# Altium schematic sheet 04_8V_GENERATION.SchDoc: =TitleParameter
size A3; Organization: ASISGUARD; Address1: Kemalpasa, Kemalpasa Cd. No:290 D:292H, 35060 Bornova/Izmir/Turkey; SheetNumber: 4; SheetTotal: 12
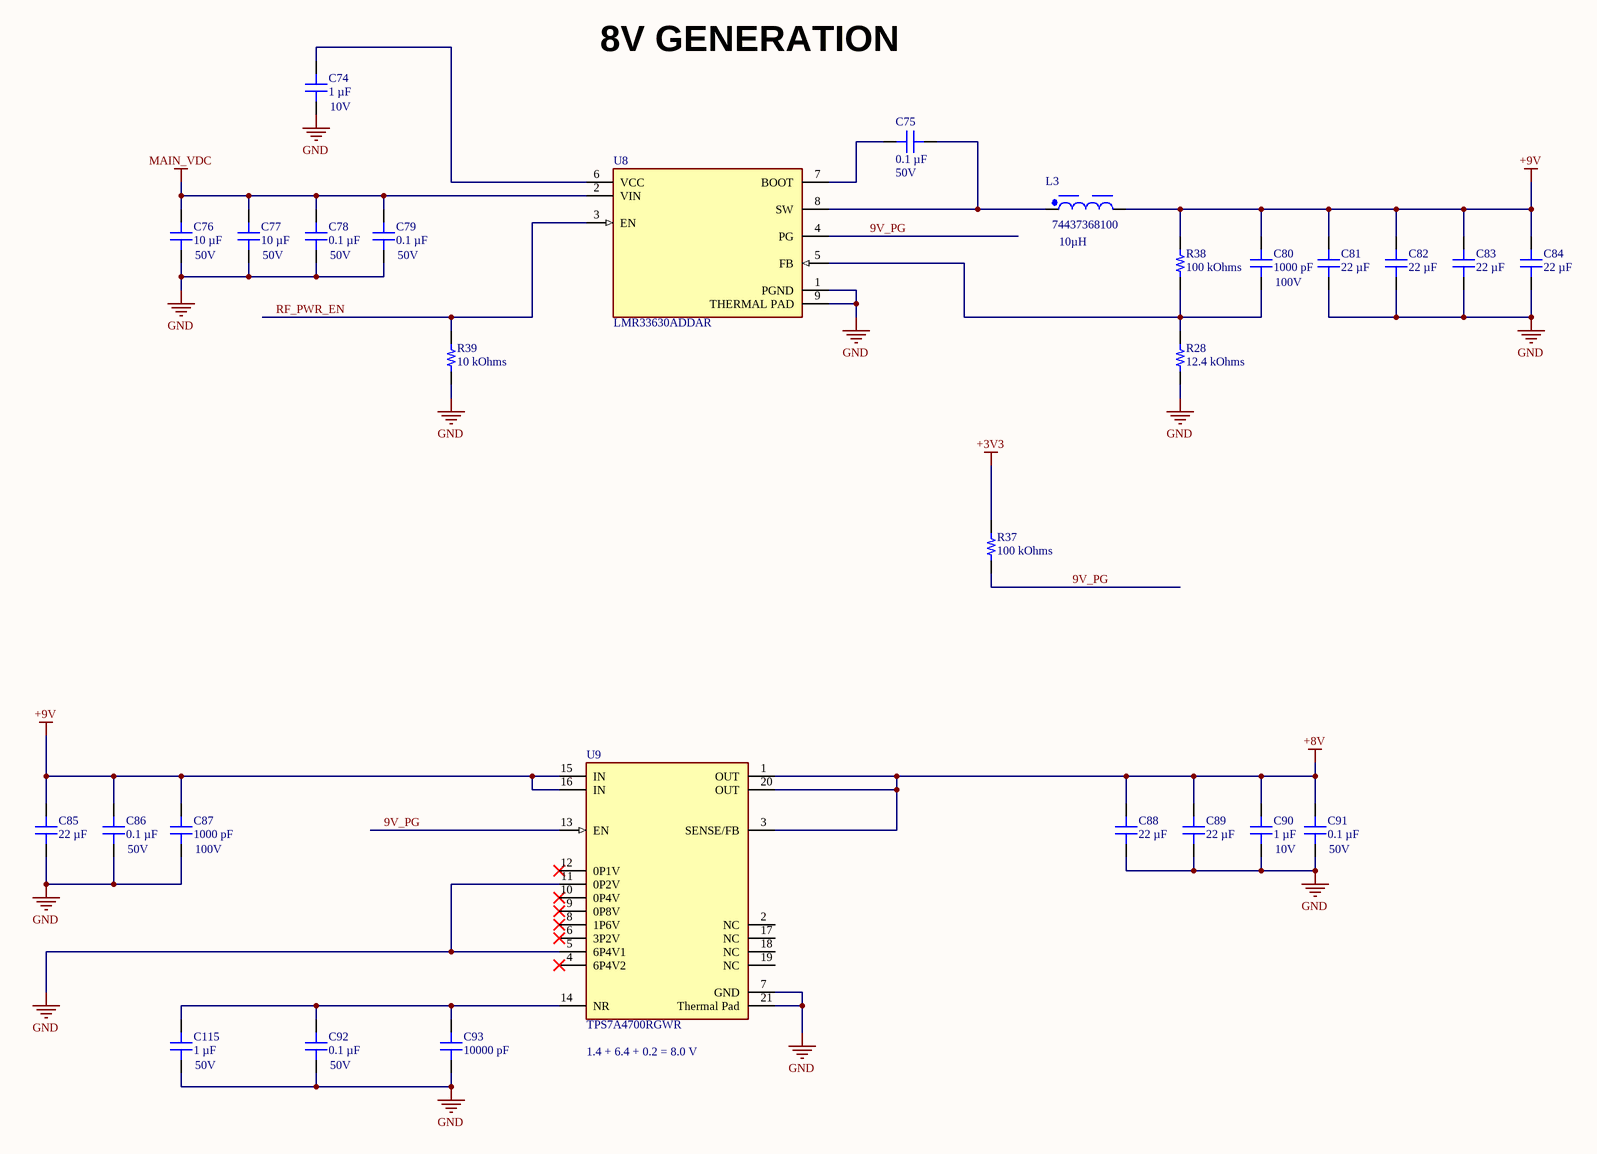
[diagram p0: 04_8V_GENERATION.SchDoc]

## Parts
C74  Voltage - Rated: 10V  [CAP 0402_1005]  (hidden comment: 1 µF)
C75  Voltage - Rated: 50V  [CAP 0402_1005]  (hidden comment: 0.1 µF)
C76  Voltage - Rated: 50V  [CAP 1206_3216 - 0.8MM]  (hidden comment: 10 µF)
C77  Voltage - Rated: 50V  [CAP 1206_3216 - 0.8MM]  (hidden comment: 10 µF)
C78  Voltage - Rated: 50V  [CAP 0402_1005]  (hidden comment: 0.1 µF)
C79  Voltage - Rated: 50V  [CAP 0402_1005]  (hidden comment: 0.1 µF)
C80  Voltage - Rated: 100V  [CAP 0402_1005]  (hidden comment: 1000 pF)
C81  22 µF  [CAP 0805_2012]
C82  22 µF  [CAP 0805_2012]
C83  22 µF  [CAP 0805_2012]
C84  22 µF  [CAP 0805_2012]
C85  22 µF  [CAP 0805_2012]
C86  Voltage - Rated: 50V  [CAP 0402_1005]  (hidden comment: 0.1 µF)
C87  Voltage - Rated: 100V  [CAP 0402_1005]  (hidden comment: 1000 pF)
C88  22 µF  [CAP 0805_2012]
C89  22 µF  [CAP 0805_2012]
C90  Voltage - Rated: 10V  [CAP 0402_1005]  (hidden comment: 1 µF)
C91  Voltage - Rated: 50V  [CAP 0402_1005]  (hidden comment: 0.1 µF)
C92  Voltage - Rated: 50V  [CAP 0402_1005]  (hidden comment: 0.1 µF)
C93  10000 pF  [CAP 0402_1005]
C115  Voltage - Rated: 50V  [CAP 0805_2012]  (hidden comment: 1 µF)
L3  74437368100  Inductance: 10µH  [WE-LHMI_1040]
R28  12.4 kOhms  [RES 0402_1005]
R37  100 kOhms  [RES 0402_1005]
R38  100 kOhms  [RES 0402_1005]
R39  10 kOhms  [RES 0402_1005]
U8  LMR33630ADDAR  [FP-DDA0008J-MFG]
U9  TPS7A4700RGWR  [FP-RGW0020A-MFG]

## Nets
+3V3: R37.2
+8V: C88.2 C89.2 C90.1 C91.2 U9.1(OUT) U9.3(SENSE/FB) U9.20(OUT)
+9V: C80.2 C81.2 C82.2 C83.2 C84.2 C85.2 C86.2 C87.2 L3.2 R38.2 U9.15(IN) U9.16(IN)
GND: C74.2 C76.1 C77.1 C78.1 C79.1 C81.1 C82.1 C83.1 C84.1 C85.1 C86.1 C87.1 C88.1 C89.1 C90.2 C91.1 C92.1 C93.1 C115.1 R28.1 R39.1 U8.1(PGND) U8.9(THERMAL_PAD) U9.5(6P4V1) U9.7(GND) U9.11(0P2V) U9.21(Thermal_Pad)
MAIN_VDC: C76.2 C77.2 C78.2 C79.2 U8.2(VIN)
9V_PG: R37.1 U8.4(PG) U9.13(EN)
RF_PWR_EN: R39.2 U8.3(EN)
NetC74_1: C74.1 U8.6(VCC)
NetC75_1: C75.1 L3.1 U8.8(SW)
NetC75_2: C75.2 U8.7(BOOT)
NetC80_1: C80.1 R28.2 R38.1 U8.5(FB)
NetC92_2: C92.2 C93.2 C115.2 U9.14(NR)

Not connected (* = marked no-connect by the designer): U9 2(NC) 4(6P4V2)* 6(3P2V)* 8(1P6V)* 9(0P8V)* 10(0P4V)* 12(0P1V)* 17(NC) 18(NC) 19(NC)

## Notes on the sheet
- 8V GENERATION
- (near U9) 1.4 + 6.4 + 0.2 = 8.0 V
- Proje/Project:
- Sayfa Adı/Document Name:
- Çizilme Tarihi/Drawing Date
- E. CAGLAV
- Tasarlayan/Designed By
- Sayfa/Sheet:
- Revision:
- of
- Son Güncelleme/Last Edit Date
- Kontrol eden/Checked By
- Onaylayan/Approved By
- Boyut/Size:
- Varyant/Variant:
- Dil/Language:
- A3
- ENG

## Library data of the parts
C74 C90 = GRM155C71A105KE11D: CAP CER 1UF 10V X7S 0402; manufacturer: Murata Electronics; Tolerance: ±10%; Part Number: GRM155C71A105KE11D; Capacitance: 1 µF; Applications: General Purpose; componentlink1description: Datasheet; componentlink1url: https://search.murata.co.jp/Ceramy/image/img/A01X/G101/ENG/GRM155C71A105KE11-01.pdf; componentlink2description: DigiKey Link; componentlink2url: https://www.digikey.com/en/products/detail/murata-electronics/GRM155C71A105KE11D/6606086; Device Package: 0402 (1005 Metric); lastupdated: 4/6/2026 7:11:12 PM; Lifecycle Status: Active; Minimum Order: 1; Mounting Type: Surface Mount, MLCC; Operating Temperature: -55°C ~ 125°C; Package / Case: 0402 (1005 Metric); packaging: TapeAndReel; partid: 1749; Part Status: Active; price: 0.01; series: GRM; Size / Dimension: 0.039" L x 0.020" W (1.00mm x 0.50mm); Supplier 1: DigiKey; Supplier Part Number 1: 490-14457-1-ND; Temperature Coefficient: X7S; Thickness (Max): 0.024" (0.60mm); value: 1 µF
C75 C78 C79 C86 C91 C92 = GCM155R71H104KE02J: CAP CER 0.1UF 50V X7R 0402; manufacturer: Murata Electronics; Tolerance: ±10%; Part Number: GCM155R71H104KE02J; Capacitance: 0.1 µF; Applications: Automotive; componentlink1description: Datasheet; componentlink1url: https://search.murata.co.jp/Ceramy/image/img/A01X/G101/ENG/GCM155R71H104KE02-01.pdf; componentlink2description: DigiKey Link; componentlink2url: https://www.digikey.com/en/products/detail/murata-electronics/GCM155R71H104KE02J/4903705; Device Package: 0402 (1005 Metric); lastupdated: 4/6/2026 7:10:30 PM; Lifecycle Status: Active; Minimum Order: 1; Mounting Type: Surface Mount, MLCC; Operating Temperature: -55°C ~ 125°C; Package / Case: 0402 (1005 Metric); packaging: TapeAndReel; partid: 11356; Part Status: Active; price: 0.01; Ratings: AEC-Q200; series: GCM; Size / Dimension: 0.039" L x 0.020" W (1.00mm x 0.50mm); Supplier 1: DigiKey; Supplier Part Number 1: 490-14514-1-ND; Temperature Coefficient: X7R; Thickness (Max): 0.022" (0.55mm); value: 0.1 µF
C76 C77 = CL31B106KBHNNNE: CAP CER 10UF 50V X7R 1206; manufacturer: Samsung Electro-Mechanics; Tolerance: ±10%; Part Number: CL31B106KBHNNNE; Capacitance: 10 µF; Applications: General Purpose; componentlink1description: Datasheet; componentlink1url: http://www.samsungsem.com/kr/support/product-search/mlcc/CL31B106KBHNNNE.jsp; componentlink2description: DigiKey Link; componentlink2url: https://www.digikey.com/en/products/detail/samsung-electro-mechanics/CL31B106KBHNNNE/5961251; Device Package: 1206 (3216 Metric); lastupdated: 4/6/2026 7:38:00 PM; Lifecycle Status: Active; Minimum Order: 1; Mounting Type: Surface Mount, MLCC; Operating Temperature: -55°C ~ 125°C; Package / Case: 1206 (3216 Metric); packaging: TapeAndReel; partid: 40563; Part Status: Active; price: 0.06; series: CL; Size / Dimension: 0.126" L x 0.063" W (3.20mm x 1.60mm); Supplier 1: DigiKey; Supplier Part Number 1: 1276-6767-1-ND; Temperature Coefficient: X7R; Thickness (Max): 0.071" (1.80mm); value: 10 µF
C80 C87 = C0402H102J1GAC7867: CAP CER 1000PF 100V C0G/NP0 0402; manufacturer: KEMET; Temperature Coefficient: C0G, NP0; Tolerance: ±5%; Part Number: C0402H102J1GAC7867; Capacitance: 1000 pF; Applications: Downhole; componentlink1description: Datasheet; componentlink1url: https://api.kemet.com/component-edge/download/datasheet/C0402H102J1GAC7867.pdf; componentlink2description: DigiKey Link; componentlink2url: https://www.digikey.com/en/products/detail/kemet/C0402H102J1GAC7867/5267578; Device Package: 0402 (1005 Metric); Features: Low ESL, High Temperature; lastupdated: 3/30/2026 7:10:31 PM; Lifecycle Status: Active; Minimum Order: 1; Mounting Type: Surface Mount, MLCC; Operating Temperature: -55°C ~ 200°C; Package / Case: 0402 (1005 Metric); packaging: TapeAndReel; partid: 3822; Part Status: Active; price: 0.24; series: SMD Indust C0G HT200C; Size / Dimension: 0.039" L x 0.020" W (1.00mm x 0.50mm); Supplier 1: DigiKey; Supplier Part Number 1: 399-11931-1-ND; Thickness (Max): 0.022" (0.55mm); value: 1000 pF
C81-C85 C88 C89 = CL21A226KOQNNNE: CAP CER 22UF 16V X5R 0805; manufacturer: Samsung Electro-Mechanics; Tolerance: ±10%; Part Number: CL21A226KOQNNNE; Capacitance: 22 µF; Applications: General Purpose; componentlink1description: Datasheet; componentlink1url: http://www.samsungsem.com/kr/support/library/product-catalog/mlcc.jsp; componentlink2description: DigiKey Link; componentlink2url: https://www.digikey.com/en/products/detail/samsung-electro-mechanics/CL21A226KOQNNNE/5961010; Device Package: 0805 (2012 Metric); lastupdated: 4/6/2026 7:33:17 PM; Lifecycle Status: Active; Minimum Order: 1; Mounting Type: Surface Mount, MLCC; Operating Temperature: -55°C ~ 85°C; Package / Case: 0805 (2012 Metric); packaging: TapeAndReel; partid: 3004; Part Status: Active; price: 0.06; series: CL; Size / Dimension: 0.079" L x 0.049" W (2.00mm x 1.25mm); Supplier 1: DigiKey; Supplier Part Number 1: 1276-6526-1-ND; Temperature Coefficient: X5R; Thickness (Max): 0.055" (1.40mm); value: 22 µF; Voltage - Rated: 16V
C93 = AC0402KPX7R9BB103: CAP CER 10000PF 50V X7R 0402; manufacturer: Yageo; Tolerance: ±10%; Part Number: AC0402KPX7R9BB103; Capacitance: 10000 pF; Applications: Automotive; componentlink1description: Datasheet; componentlink1url: http://www.yageo.com/documents/recent/UPY-AC_NP0X7R_16V-to-630V_12.pdf; componentlink2description: DigiKey Link; componentlink2url: https://www.digikey.com/en/products/detail/yageo/AC0402KPX7R9BB103/6643253; Device Package: 0402 (1005 Metric); lastupdated: 4/6/2026 7:11:07 PM; Lifecycle Status: Active; Minimum Order: 1; Mounting Type: Surface Mount, MLCC; Operating Temperature: -55°C ~ 125°C; Package / Case: 0402 (1005 Metric); packaging: CutTape; partid: 2384; Part Status: Active; price: 0.01; Ratings: AEC-Q200; series: AC; Size / Dimension: 0.039" L x 0.020" W (1.00mm x 0.50mm); Supplier 1: DigiKey; Supplier Part Number 1: 311-3267-1-ND; Temperature Coefficient: X7R; Thickness (Max): 0.022" (0.55mm); value: 10000 pF; Voltage - Rated: 50V
C115 = UMF212B7105KGHT: CAP CER 1UF 50V X7R 0805; manufacturer: Taiyo Yuden; Tolerance: ±10%; Part Number: UMF212B7105KGHT; Capacitance: 1 µF; Applications: Automotive, SMPS Filtering; componentlink1description: Datasheet; componentlink1url: https://ds.yuden.co.jp/TYCOMPAS/ut/detail?pn=UMF212B7105KGHT&u=M; componentlink2description: DigiKey Link; componentlink2url: https://www.digikey.com/en/products/detail/taiyo-yuden/UMF212B7105KGHT/10379089; Device Package: 0805 (2012 Metric); lastupdated: 4/6/2026 7:32:13 PM; Lifecycle Status: Active; Minimum Order: 1; Mounting Type: Surface Mount, MLCC; Operating Temperature: -55°C ~ 125°C; Package / Case: 0805 (2012 Metric); packaging: TapeAndReel; partid: 26382; Part Status: Active; price: 0.04; Ratings: AEC-Q200; series: M; Size / Dimension: 0.079" L x 0.049" W (2.00mm x 1.25mm); Supplier 1: DigiKey; Supplier Part Number 1: 587-6523-1-ND; Temperature Coefficient: X7R; Thickness (Max): 0.053" (1.35mm); value: 1 µF
L3 = CMP-1353-00006-7: We-lhmi; 10000NH; Composite Iron Multilayer SMD Induc., 1040 Case; .012GHZ 5.2A; Self Resonant Frequency: 12MHz; Test Frequency: 100kHz; Inductance Tolerance: 20%; Shielding: Shielded; DC Resistance (DCR): 27mΩ; Series Resistance: 30mΩ; Core Material: Composite, Ferrite; Saturation Current: 7.9A; Case/Package: Nonstandard; Ambient Temperature Range Low: -40°C; Height - Seated (Max): 3.9878mm; Max Operating Temperature: 125°C; REACH SVHC: Unknown; Height: 3.8mm; Mount: Surface Mount; Termination: SMD/SMT; Current Rating: 5.2A; Width: 10mm; Frequency: 12MHz; Max DC Current: 5.2A; Composition: Wirewound; Tolerance: 20%; Min Operating Temperature: -40°C; RoHS: Compliant; Length: 11mm; RMS Current (Irms): 5.2A; Depth: 10mm; Ambient Temperature Range High: 85°C
R28 = RT0402FRE0712K4L: RES SMD 12.4K OHM 1% 1/16W 0402; Manufacturer: Yageo; Power (Watts): 0.063W, 1/16W; Temperature Coefficient: ±50ppm/°C; Part Number: RT0402FRE0712K4L; Value: 12.4 kOhms; ComponentLink1Description: Datasheet; ComponentLink1URL: https://www.yageo.com/upload/media/product/productsearch/datasheet/rchip/PYu-RT_1-to-0.01_RoHS_L_12.pdf; ComponentLink2Description: DigiKey Link; ComponentLink2URL: https://www.digikey.com/en/products/detail/yageo/RT0402FRE0712K4L/1071739; Composition: Thin Film; Device Package: 0402 (1005 Metric); Height - Seated (Max): 0.014" (0.35mm); LastUpdated: 4/6/2026 7:40:57 PM; Lifecycle Status: Active; Minimum Order: 1; Number of Terminations: 2; Operating Temperature: -55°C ~ 155°C; Package / Case: 0402 (1005 Metric); Packaging: TapeAndReel; PartId: 64983; Part Status: Active; Price: 0.01; Resistance: 12.4 kOhms; Series: RT; Size / Dimension: 0.039" L x 0.020" W (1.00mm x 0.50mm); Supplier 1: DigiKey; Supplier Part Number 1: 13-RT0402FRE0712K4LCT-ND; Supplier Device Package: 0402; Tolerance: ±1%
R37 = AC0402FR-07100KL: RES SMD 100K OHM 1% 1/16W 0402; Manufacturer: Yageo; Power (Watts): 0.063W, 1/16W; Temperature Coefficient: ±100ppm/°C; Part Number: AC0402FR-07100KL; Value: 100 kOhms; ComponentLink1Description: Datasheet; ComponentLink1URL: https://www.yageo.com/upload/media/product/productsearch/datasheet/rchip/PYu-AC_51_RoHS_L_7.pdf; ComponentLink2Description: DigiKey Link; ComponentLink2URL: https://www.digikey.com/en/products/detail/yageo/AC0402FR-07100KL/5895021; Composition: Thick Film; Device Package: 0402 (1005 Metric); Features: Automotive AEC-Q200, Moisture Resistant; Height - Seated (Max): 0.015" (0.37mm); LastUpdated: 4/6/2026 7:41:12 PM; Lifecycle Status: Active; Minimum Order: 1; Number of Terminations: 2; Operating Temperature: -55°C ~ 155°C; Package / Case: 0402 (1005 Metric); Packaging: CutTape; PartId: 12047; Part Status: Active; Price: 0.01; Ratings: AEC-Q200; Resistance: 100 kOhms; Series: AC; Size / Dimension: 0.039" L x 0.020" W (1.00mm x 0.50mm); Supplier 1: DigiKey; Supplier Part Number 1: YAG3434CT-ND; Supplier Device Package: 0402; Tolerance: ±1%
R38 = RC0402FR-13100KL: RES 100K OHM 1% 1/16W 0402; Manufacturer: Yageo; Power (Watts): 0.063W, 1/16W; Temperature Coefficient: ±100ppm/°C; Part Number: RC0402FR-13100KL; Value: 100 kOhms; ComponentLink1Description: Datasheet; ComponentLink1URL: https://www.yageo.com/upload/media/product/productsearch/datasheet/rchip/PYu-RC_Group_51_RoHS_L_11.pdf; ComponentLink2Description: DigiKey Link; ComponentLink2URL: https://www.digikey.com/en/products/detail/yageo/RC0402FR-13100KL/13546624; Composition: Thick Film; Device Package: 0402 (1005 Metric); Features: Moisture Resistant; Height - Seated (Max): 0.016" (0.40mm); LastUpdated: 4/6/2026 7:40:59 PM; Lifecycle Status: Active; Minimum Order: 1; Number of Terminations: 2; Operating Temperature: -55°C ~ 155°C; Package / Case: 0402 (1005 Metric); Packaging: CutTape; PartId: 59069; Part Status: Active; Price: 0.01; Resistance: 100 kOhms; Series: RC_L; Size / Dimension: 0.039" L x 0.020" W (1.00mm x 0.50mm); Supplier 1: DigiKey; Supplier Part Number 1: 13-RC0402FR-13100KLCT-ND; Supplier Device Package: 0402; Tolerance: ±1%
R39 = RC0402FR-0710KL: RES 10K OHM 1% 1/16W 0402; Manufacturer: Yageo; Power (Watts): 0.063W, 1/16W; Temperature Coefficient: ±100ppm/°C; Part Number: RC0402FR-0710KL; Value: 10 kOhms; ComponentLink1Description: Datasheet; ComponentLink1URL: https://www.yageo.com/upload/media/product/productsearch/datasheet/rchip/PYu-RC_Group_51_RoHS_L_10.pdf; ComponentLink2Description: DigiKey Link; ComponentLink2URL: https://www.digikey.com/en/products/detail/yageo/RC0402FR-0710KL/726523; Composition: Thick Film; Device Package: 0402 (1005 Metric); Features: Moisture Resistant; Height - Seated (Max): 0.016" (0.40mm); LastUpdated: 4/6/2026 7:41:07 PM; Lifecycle Status: Active; Minimum Order: 1; Number of Terminations: 2; Operating Temperature: -55°C ~ 155°C; Package / Case: 0402 (1005 Metric); Packaging: CutTape; PartId: 17593; Part Status: Active; Price: 0.01; Resistance: 10 kOhms; Series: RC_L; Size / Dimension: 0.039" L x 0.020" W (1.00mm x 0.50mm); Supplier 1: DigiKey; Supplier Part Number 1: 311-10.0KLRCT-ND; Supplier Device Package: 0402; Tolerance: ±1%
U8 = CMP-04918-000184-1: IC REG BUCK ADJUSTABLE 3A 8SOPWR; Switching Frequency: 400kHz; Number of Outputs: 1; Output Configuration: Positive; Synchronous Rectifier: Yes; Min Output Voltage: 1V; Max Output Voltage: 24V; Max Input Voltage: 36V; Min Input Voltage: 3.8V; Output Current: 3A; Min Operating Temperature: -40°C; Max Operating Temperature: 125°C; Number of Pins: 8; RoHS Compliant: Yes; Mount: Surface Mount; Output Type: Adjustable; Packaging: Cut Tape
U9 = CMP-04917-000027-1: IC REG LINEAR POS ADJ 1A 20VQFN; Manufacturer: Texas Instruments; Output Type: AdjustableProgrammable; Output Voltage: 1.4-20.5V; Nominal Supply Current: 0.58-6.1mA; Max Supply Voltage: 35V; Accuracy Percentage: 1%; Standoff Height: 0mm; Min Supply Voltage: 3V; Max Junction Temp: +125°C; Number Of Outputs: 1; Dropout Voltage: 307mV; RoHS: TRUE; Automotive: No; Temperature Range Low: -40°C; Octopart: https://octopart.com/tps7a4700rgwr-texas+instruments-21221956; Digikey Description: IC REG LINEAR POS ADJ 1A 20VQFN; Temperature: -40°C to +125°C; Device Class L2: Power Management ICs; Manufacturer Part Number: TPS7A4700RGWR; Device Class L1: Integrated Circuits (ICs); Lead Free: Yes; Category: IC; Temperature Range High: +125°C; Package: RGW0020A; Output Current: 1A; ComponentLink2URL: http://www.ti.com/lit/ds/symlink/tps7a47.pdf; ComponentLink2Description: Datasheet; Mouser Description: LDO Voltage Regulators Low Noise,1A,Hi Vltg LDO Reg; Height: 1mm; Device Class L3: Voltage Regulators - Linear